# EAGLE design myPowerSatBoard (EAGLE 6.6.0)
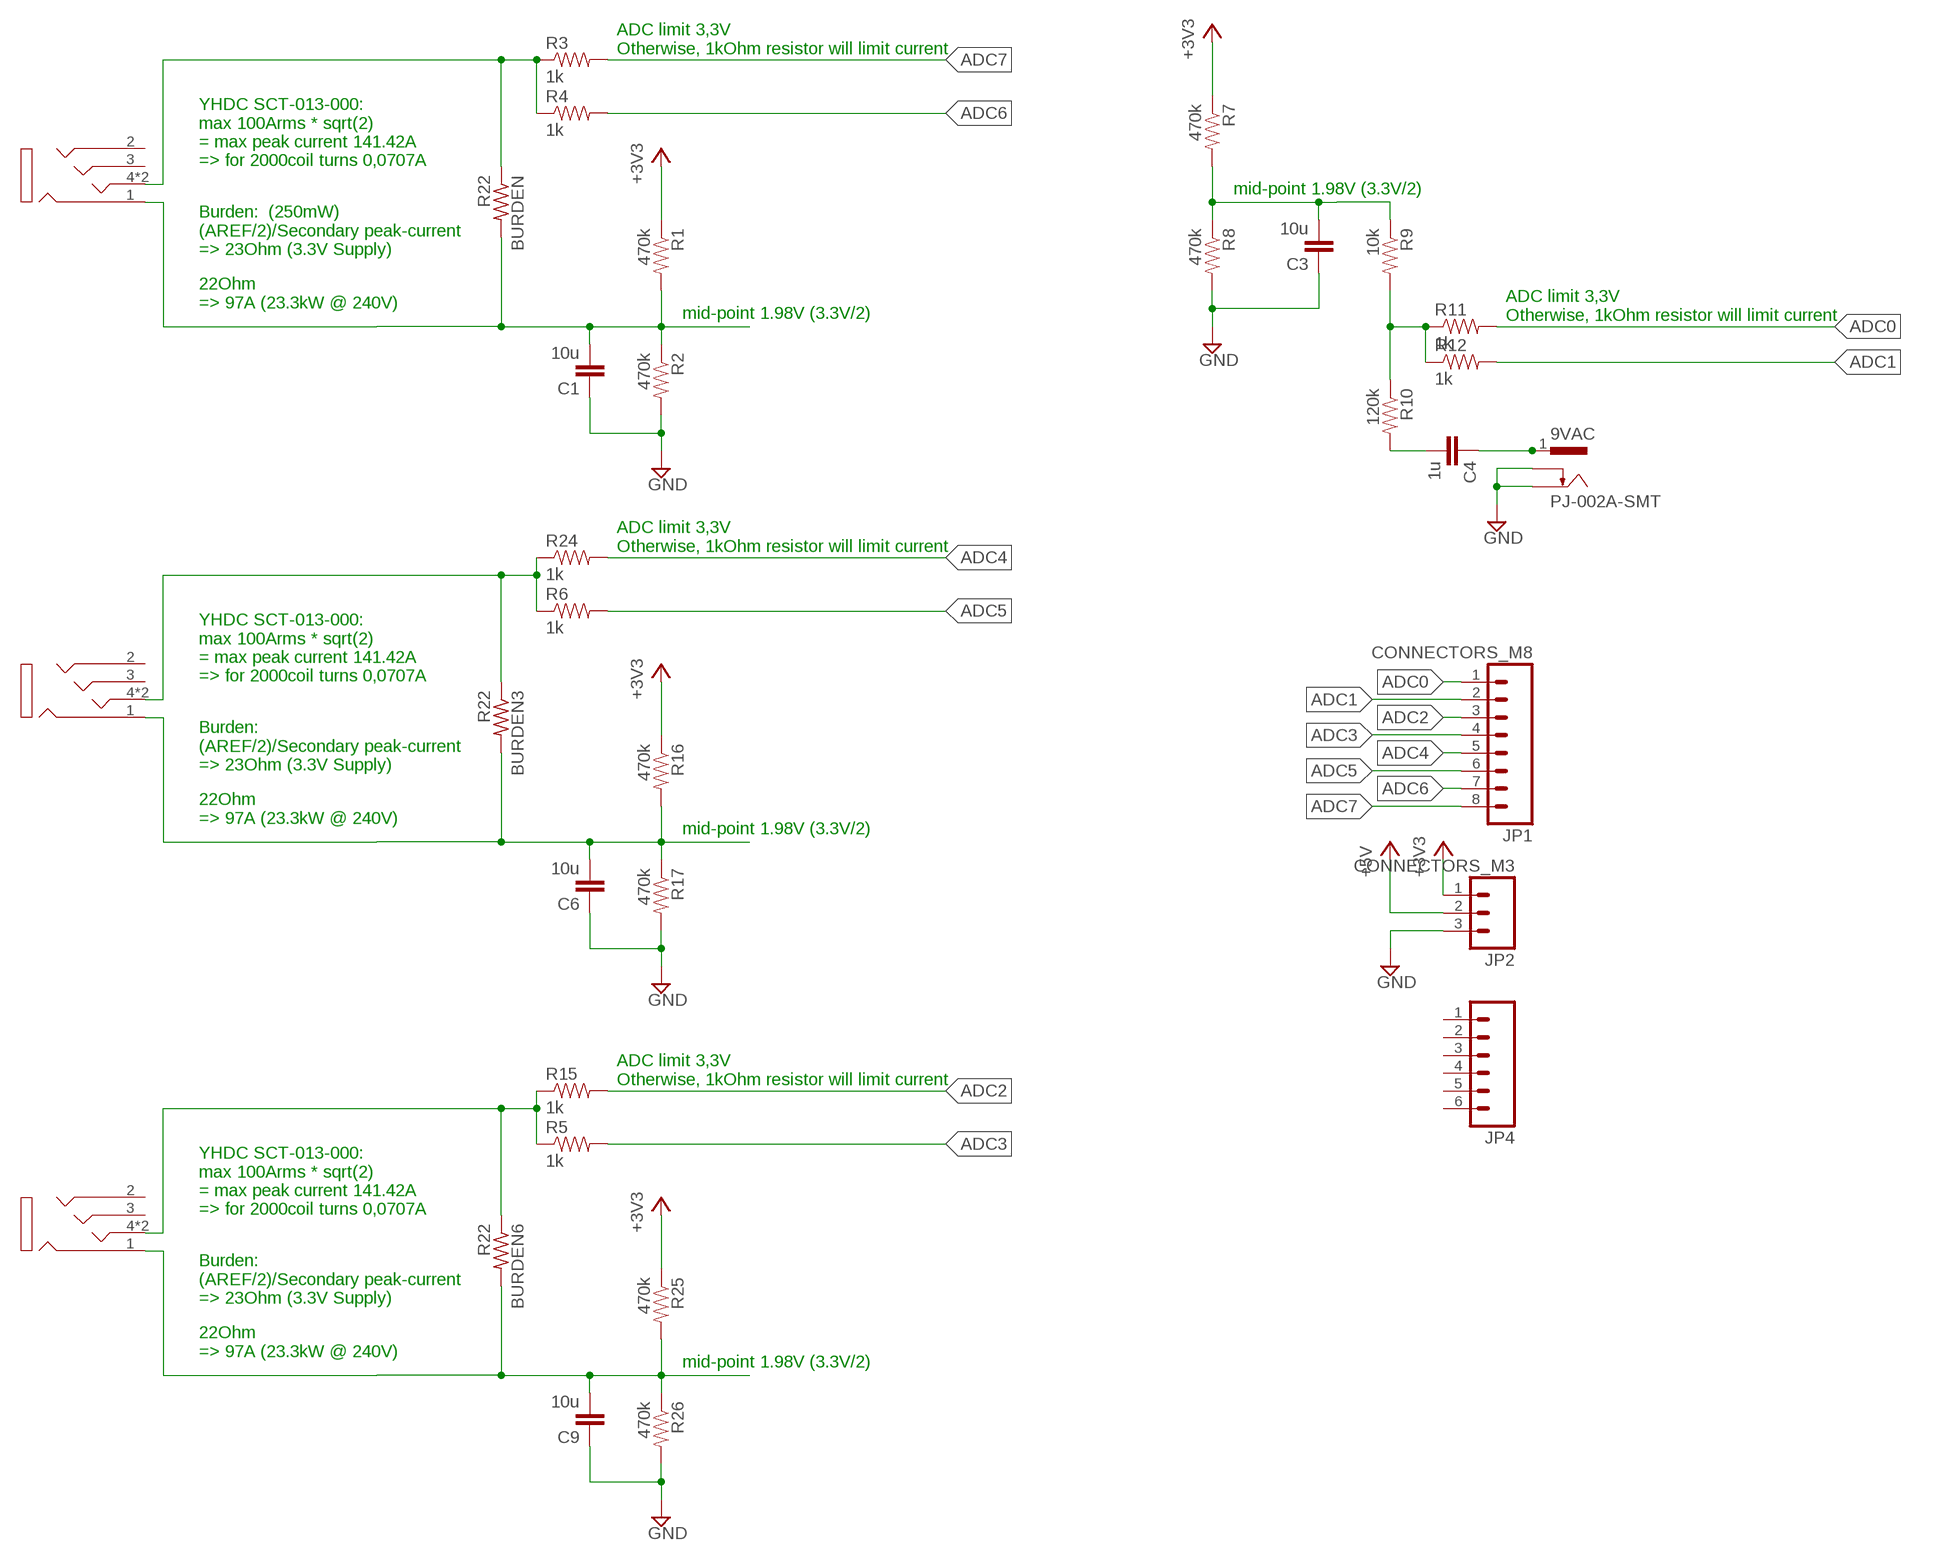
[diagram p0: schematic, sheet 1]

## Parts
9VAC  PJ-002A-SMT  [CUI_PJ-002B-SMT]
BURDEN  R22  R-US_R0805  [R0805]
BURDEN3  R22  R-US_R0805  [R0805]
BURDEN6  R22  R-US_R0805  [R0805]
C1  10u  CAP0603-CAP  [0603-CAP]
C3  10u  CAP0603-CAP  [0603-CAP]
C4  1u  CAP0603-CAP  [0603-CAP]
C6  10u  CAP0603-CAP  [0603-CAP]
C9  10u  CAP0603-CAP  [0603-CAP]
CT1  1503_13  [1503-03]
CT4  1503_13  [1503-03]
CT7  1503_13  [1503-03]
JP1  CONNECTORS_M8  [CONNECTORS_1X8]
JP2  CONNECTORS_M3  [CONNECTORS_1X3]
JP4  CONNECTORS_M06SIP  [CONNECTORS_1X06]
R1  470k  RESISTOR0603-RES  [0603-RES]
R2  470k  RESISTOR0603-RES  [0603-RES]
R3  1k  RESISTOR0603-RES  [0603-RES]
R4  1k  RESISTOR0603-RES  [0603-RES]
R5  1k  RESISTOR0603-RES  [0603-RES]
R6  1k  RESISTOR0603-RES  [0603-RES]
R7  470k  RESISTOR0603-RES  [0603-RES]
R8  470k  RESISTOR0603-RES  [0603-RES]
R9  10k  RESISTOR0603-RES  [0603-RES]
R10  120k  RESISTOR0603-RES  [0603-RES]
R11  1k  RESISTOR0603-RES  [0603-RES]
R12  1k  RESISTOR0603-RES  [0603-RES]
R15  1k  RESISTOR0603-RES  [0603-RES]
R16  470k  RESISTOR0603-RES  [0603-RES]
R17  470k  RESISTOR0603-RES  [0603-RES]
R24  1k  RESISTOR0603-RES  [0603-RES]
R25  470k  RESISTOR0603-RES  [0603-RES]
R26  470k  RESISTOR0603-RES  [0603-RES]

## Nets
+3V3 [power]: JP2.1 R1.1 R7.1 R16.1 R25.1
+5V: JP2.2
ADC0: JP1.1 R11.2
ADC1: JP1.2 R12.2
ADC2: JP1.3 R15.2
ADC3: JP1.4 R5.2
ADC4: JP1.5 R24.2
ADC5: JP1.6 R6.2
ADC6: JP1.7 R4.2
ADC7: JP1.8 R3.2
GND: 9VAC.3 9VAC.4 C1.1 C3.1 C6.1 C9.1 JP2.3 R2.2 R8.2 R17.2 R26.2
N$1: BURDEN.2 C1.2 CT1.1 R1.2 R2.1
N$3: BURDEN.1 CT1.4 CT1.4-2 R3.1 R4.1
N$5: C3.2 R7.2 R8.1 R9.1
N$7: R9.2 R10.1 R11.1 R12.1
N$8: C4.2 R10.2
N$10: 9VAC.1 9VAC.2 C4.1
N$11: BURDEN3.2 C6.2 CT4.1 R16.2 R17.1
N$12: BURDEN3.1 CT4.4 CT4.4-2 R6.1 R24.1
N$17: BURDEN6.2 C9.2 CT7.1 R25.2 R26.1
N$18: BURDEN6.1 CT7.4 CT7.4-2 R5.1 R15.1
Unconnected: CT1.2 CT1.3 CT4.2 CT4.3 CT7.2 CT7.3 JP4.1 JP4.2 JP4.3 JP4.4 JP4.5 JP4.6

## Notes on the sheet
- ADC limit 3,3V
  Otherwise, 1kOhm resistor will limit current
- YHDC SCT-013-000: 
  max 100Arms * sqrt(2)
  = max peak current 141.42A
  => for 2000coil turns 0,0707A
- mid-point 1.98V (3.3V/2)
- Burden:  (250mW)
  (AREF/2)/Secondary peak-current
  => 23Ohm (3.3V Supply)
- 22Ohm 
  => 97A (23.3kW @ 240V)
- mid-point 1.98V (3.3V/2)
- ADC limit 3,3V
  Otherwise, 1kOhm resistor will limit current
- ADC limit 3,3V
  Otherwise, 1kOhm resistor will limit current
- YHDC SCT-013-000: 
  max 100Arms * sqrt(2)
  = max peak current 141.42A
  => for 2000coil turns 0,0707A
- Burden:
  (AREF/2)/Secondary peak-current
  => 23Ohm (3.3V Supply)
- 22Ohm 
  => 97A (23.3kW @ 240V)
- mid-point 1.98V (3.3V/2)
- ADC limit 3,3V
  Otherwise, 1kOhm resistor will limit current
- YHDC SCT-013-000: 
  max 100Arms * sqrt(2)
  = max peak current 141.42A
  => for 2000coil turns 0,0707A
- Burden:
  (AREF/2)/Secondary peak-current
  => 23Ohm (3.3V Supply)
- 22Ohm 
  => 97A (23.3kW @ 240V)
- mid-point 1.98V (3.3V/2)

## Library data of the parts
9VAC = con-cui-inc:PJ-002A-SMT; BUERKLIN: 40 F 1345
BURDEN BURDEN3 BURDEN6 = resistor:R-US_: RESISTOR, American symbol; BUERKLIN: 11 E 808
C1 C3 C6 C9 = LowPowerLab:CAP: Capacitor Standard 0603 ceramic capacitor, and 0.1" leaded capacitor.; BUERKLIN: 53 D 2088
C4 = LowPowerLab:CAP: Capacitor Standard 0603 ceramic capacitor, and 0.1" leaded capacitor.; BUERKLIN: 53 D 2083
CT1 CT4 CT7 = myLib:1503_13; BUERKLIN: 39F1215
JP1 = myLib:CONNECTORS_M8: 13-pin single row .1" header
JP2 = myLib:CONNECTORS_M3: 13-pin single row .1" header
JP4 = myLib:CONNECTORS_M06
R1 R2 R7 R8 R16 R17 R25 R26 = LowPowerLab:RESISTOR: Resistor Basic schematic elements and footprints for 0603, 1206, and PTH resistors.; BUERKLIN: 26 E 856
R3-R6 R11 R12 R15 R24 = LowPowerLab:RESISTOR: Resistor Basic schematic elements and footprints for 0603, 1206, and PTH resistors.; BUERKLIN: 26 E 792
R9 = LowPowerLab:RESISTOR: Resistor Basic schematic elements and footprints for 0603, 1206, and PTH resistors.; BUERKLIN: 26 E 816
R10 = LowPowerLab:RESISTOR: Resistor Basic schematic elements and footprints for 0603, 1206, and PTH resistors.; BUERKLIN: 26 E 842

## Net classes
0 default: width 0.254 mm
1 power: width 0.381 mm, clearance 0.381 mm
2 ANT: width 1.27 mm, clearance 0.254 mm

## Board
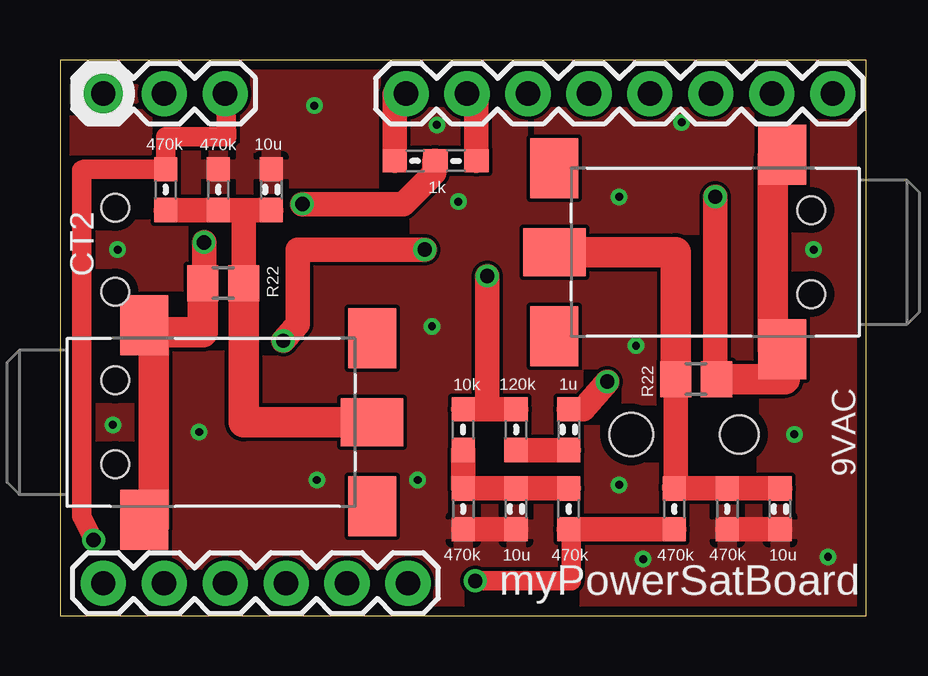
[diagram p1: board, top side]
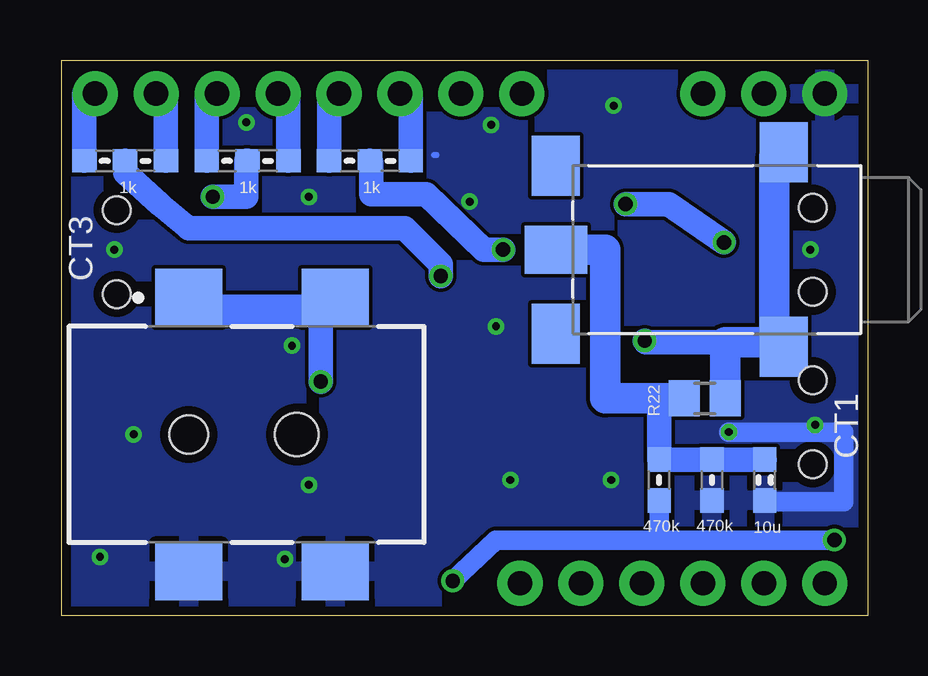
[diagram p2: board, bottom side, seen from below]

Size 33.6 x 23.15 mm. Coordinates in mm from the lower left corner, seen from the top.
Outline: 0,0 33.6,0 33.6,23.15 0,23.15 0,0
Copper layers (1*16): Top 0.0356mm / dielectric 1.5011mm / Bottom 0.0356mm
Design rules "LaenPCBOrder": minimum track width 6mil, minimum drill 13mil, track to track 6mil, track to pad 6mil, pad to pad 6mil, via to via 6mil, smd to smd 6mil, copper to edge 15mil, drill to drill 6mil, minimum pad ring 7mil, minimum via ring 7mil, stop-mask expansion 3mil, vias tented up to drill 0mil, thermal gap 10mil

### Footprints (pad centres in the part's own frame; a part is rotated, then mirrored left to right if it is on the bottom)
CUI_PJ-002B-SMT = smd 2.4 x 2.8: 1 -5.7,11.1; 2 -5.7,5; 3 5.7,5; 4 5.7,11.1 | hole 1.8: 0,9.5 | hole 1.6: 0,5
R0805 = smd 1.3 x 1.5: 1 -0.85,0; 2 0.85,0
0603-CAP = smd 1.016 x 0.965: 1 -0.85,0; 2 0.85,0
1503-03 = smd 2.6 x 2: 1 12.7,0 | smd 2 x 2.5: 2 12.7,-3.5; 3 12.7,3.5; 4 3.2,4.05; 4-2 3.2,-4.05 | hole 1.15: 2,-1.75; 2,1.75
CONNECTORS_1X8 = drill 1.016 pad 1.88: 1 0,0; 2 2.54,0; 3 5.08,0; 4 7.62,0; 5 10.16,0; 6 12.7,0; 7 15.24,0; 8 17.78,0
CONNECTORS_1X3 = drill 1.016 pad 1.88: 1 0,0; 2 2.54,0; 3 5.08,0
CONNECTORS_1X06 = drill 1.016 pad 1.88: 1 0,0; 2 2.54,0; 3 5.08,0; 4 7.62,0; 5 10.16,0; 6 12.7,0
0603-RES = smd 1.016 x 0.965: 1 -0.85,0; 2 0.85,0

### Placement (x,y rotation side)
9VAC  33.3,7.55 270 bottom
BURDEN  6.8,13.85 0 top
BURDEN3  6.8,9.05 180 bottom
BURDEN6  26.5,9.85 180 top
C1  8.8,17.75 270 top
C3  19,4.45 90 top
C4  21.2,7.75 270 top
C6  4.3,5.65 90 bottom
C9  30,4.45 90 top
CT1  0.3,8.05 0 top
CT4  0.3,15.25 180 bottom
CT7  33.3,15.15 180 top
JP1  32.2,21.75 180 top
JP2  6.88,21.75 180 top
JP4  14.5,1.35 180 top
R1  4.4,17.75 270 top
R2  6.6,17.75 90 top
R3  14.8,18.95 180 top
R4  16.5,18.95 0 top
R5  25,18.95 0 bottom
R6  19.9,18.95 0 bottom
R7  21.2,4.45 90 top
R8  16.8,4.45 270 top
R9  16.8,7.75 90 top
R10  19,7.75 270 top
R11  31.8,18.95 180 bottom
R12  30.1,18.95 0 bottom
R15  26.7,18.95 180 bottom
R16  8.7,5.65 90 bottom
R17  6.5,5.65 270 bottom
R24  21.6,18.95 180 bottom
R25  25.6,4.45 90 top
R26  27.8,4.45 270 top

### Tracks (layer width: path | path; a pad name or v marks a point on that pad's centre or on a via)
+3V3  (via drill 0.6)
  Top 0.813: v1.4,3.15 0.9,4.15 0.9,18.55 1,18.6 R1.1 4.4,19.95 6.94,19.95 JP2.1 | v17.3,1.45 21.3,1.45 21.3,3.15 R7.1
  Top 1.016: R25.1 R7.1
  Bottom 0.813: R16.1 8.7,3.15 | v1.4,3.15 1.7,3.15 8.7,3.15 | 8.7,3.15 14.8,3.15 15.5,3.15 v17.3,1.45
ADC0
  Bottom 1.016: JP1.1 32.65,21.75 R11.2
ADC1
  Bottom 1.016: JP1.2 29.25,21.75 R12.2
ADC2
  Bottom 1.016: JP1.3 27.55,21.75 R15.2
ADC3
  Bottom 1.016: JP1.4 24.15,21.75 R5.2
ADC4
  Bottom 1.016: JP1.5 22.45,21.75 R24.2
ADC5
  Bottom 1.016: JP1.6 19.05,21.75 R6.2
ADC6
  Top 1.016: JP1.7 17.35,21.75 R4.2
ADC7
  Top 1.016: JP1.8 13.95,21.75 R3.2
GND  (via drill 0.33)
  Top 1.016: R8.2 C3.1 | C9.1 R26.2
  Bottom 0.254: 18.08,19.2 17.98,19.2 18.08,19.2
  Bottom 0.813: v5.8,7.65 1,7.65 1,4.75 4.3,4.75 C6.1
  other vias: 32,2.45 14.9,5.65 16.6,17.25 23.3,17.45 23.3,5.45 24,11.25 2.4,15.25 15.5,12.05 10.7,5.65 30.6,7.55 31.4,15.25 24.3,2.35 10.6,21.25 25.9,20.55 15.7,20.45 2.2,7.95
  pour Top: -1.7,24.15 35.3,24.15 35.3,-0.85 -1.7,-0.85
  pour Bottom: -1.7,24.15 35.3,24.15 35.3,-0.85 -1.7,-0.85
N$1
  Top 1.016: R2.1 C1.2 7.6,16.9 | 7.6,16.9 7.7,16.9 R1.2 | BURDEN.2 7.65,16.45 7.6,16.9
  Top 1.27: CT1.1 7.65,8.05 BURDEN.2
N$3  (via drill 0.6)
  Top 1.016: R4.1 15.6,18.95 15.6,18.45 15.3,18.15 14.3,17.15 v10.1,17.15 | v6,15.55 6,14.25 BURDEN.1
  Top 1.27: CT1.4 3.9,11.8 | 3.9,11.8 5.95,11.8 BURDEN.1 | CT1.4-2 3.9,3.7 3.9,11.8
  Bottom 1.016: v6,15.55 8.3,17.15 v10.1,17.15
N$5
  Top 1.016: R9.1 R8.1 C3.2 R7.2
N$7  (via drill 0.6)
  Top 1.016: R10.1 17.8,8.6 | 17.8,8.6 R9.2 | v17.8,14.15 17.8,8.6
  Bottom 1.016: R12.1 30.95,18.45 29.5,17.15 28.3,16.15 19.3,16.15 17.8,14.65 v17.8,14.15
N$8
  Top 1.016: R10.2 C4.2
N$10  (via drill 0.6)
  Top 1.016: C4.1 21.8,8.6 v22.8,9.75
  Bottom 1.016: v22.8,9.75 22.8,12.75 22.3,13.15 9VAC.1
  Bottom 1.27: 22.8,12.75 28.3,12.75 9VAC.2
N$11
  Bottom 1.016: C6.2 R17.1 7.4,6.5 R16.2 8.7,9.15 BURDEN3.2
  Bottom 1.27: CT4.1 10.95,15.25 10.95,9.05 BURDEN3.2
N$12  (via drill 0.6)
  Top 1.016: v9.3,11.45 9.9,12.15 9.9,15.25 13.3,15.25 v15.2,15.25
  Bottom 1.016: R6.1 20.7,18.9 20.7,17.55 18.4,17.55 16,15.25 v15.2,15.25 | 5.95,11.4 9.25,11.4 v9.3,11.45
  Bottom 1.27: CT4.4 3.9,11.4 | 3.9,11.4 3.9,19.15 3.5,19.15 CT4.4-2 | 3.9,11.4 5.95,11.4 BURDEN3.1
N$17
  Top 1.016: C9.2 R26.1 R25.2 25.65,5.7 BURDEN6.2
  Top 1.27: CT7.1 25.65,15.15 BURDEN6.2
N$18  (via drill 0.6)
  Top 1.016: v27.3,17.45 27.3,10.15 BURDEN6.1
  Top 1.27: BURDEN6.1 30.2,9.85 CT7.4 29.7,11.1 29.7,19.15 30.2,19.15 CT7.4-2
  Bottom 1.016: R5.1 25.9,18.95 25.9,17.45 26.3,17.45 v27.3,17.45

### Text on the board
tNames: CT2 | myPowerSatBoard
bNames: CT3 | CT1